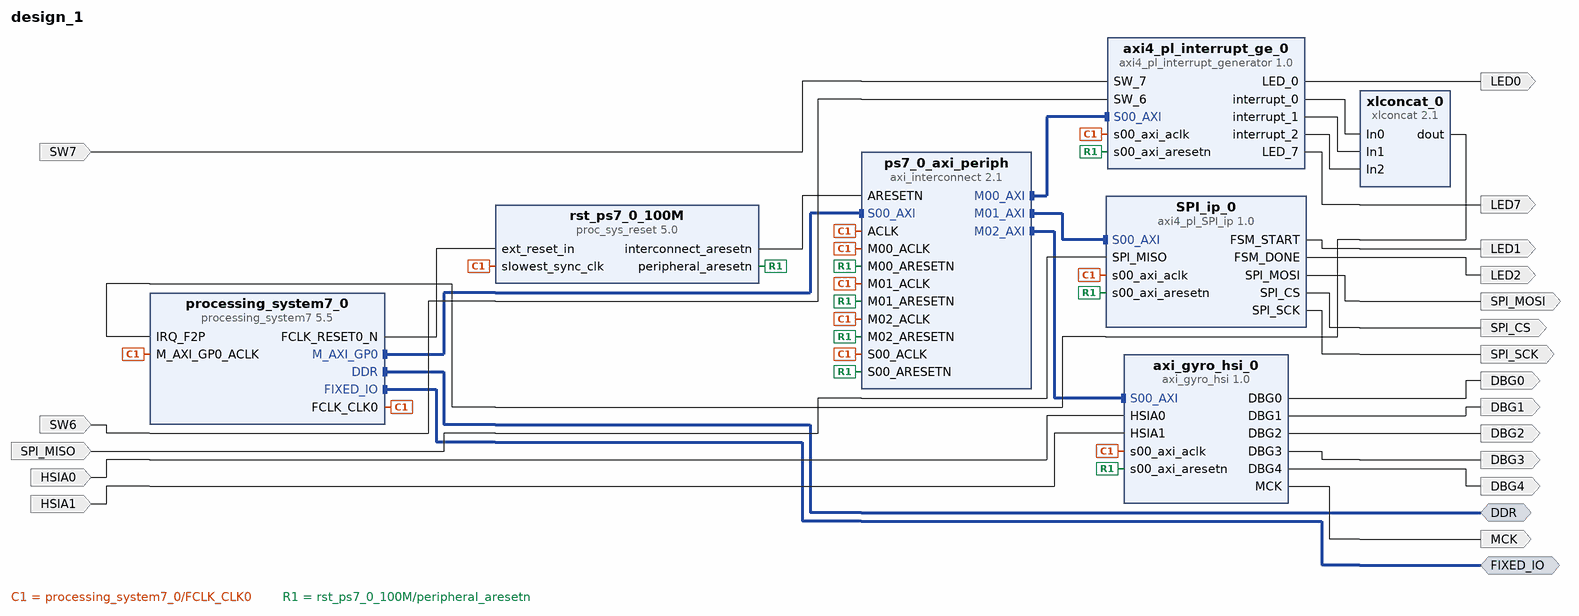
[diagram p0: block diagram of the top level]
# Vivado block design design_1, xc7z020clg484-1, Vivado 2018.2
create_bd_design design_1

create_bd_intf_port -mode Master -vlnv xilinx.com:interface:ddrx_rtl:1.0 DDR
create_bd_intf_port -mode Master -vlnv xilinx.com:display_processing_system7:fixedio_rtl:1.0 FIXED_IO
create_bd_port -dir O -type data LED0
create_bd_port -dir I -type data SW7
create_bd_port -dir O -type data LED7
create_bd_port -dir I -type data SW6
create_bd_port -dir I -type data SPI_MISO
create_bd_port -dir O -type data SPI_MOSI
create_bd_port -dir O -type data SPI_SCK
create_bd_port -dir O -type data SPI_CS
create_bd_port -dir O -type data LED1
create_bd_port -dir O -type data LED2
create_bd_port -dir I -type data HSIA0
create_bd_port -dir I -type data HSIA1
create_bd_port -dir O -type data DBG0
create_bd_port -dir O -type data DBG1
create_bd_port -dir O -type data DBG2
create_bd_port -dir O -type data DBG3
create_bd_port -dir O -type data DBG4
create_bd_port -dir O -type data MCK

create_bd_cell -type ip -vlnv xilinx.com:ip:processing_system7:5.5 processing_system7_0
set_property -dict [list \
  CONFIG.PCW_UIPARAM_DDR_FREQ_MHZ 533.333313 \
  CONFIG.PCW_APU_PERIPHERAL_FREQMHZ 666.666667 \
  CONFIG.PCW_SDIO_PERIPHERAL_FREQMHZ 50 \
  CONFIG.PCW_UART_PERIPHERAL_FREQMHZ 50 \
  CONFIG.PCW_FPGA0_PERIPHERAL_FREQMHZ 100.000000 \
  CONFIG.PCW_FPGA1_PERIPHERAL_FREQMHZ 150.000000 \
  CONFIG.PCW_USE_FABRIC_INTERRUPT 1 \
  CONFIG.PCW_IRQ_F2P_INTR 1 \
  CONFIG.PCW_PRESET_BANK1_VOLTAGE {LVCMOS 1.8V} \
  CONFIG.PCW_UIPARAM_DDR_PARTNO {MT41J128M16 HA-15E} \
  CONFIG.PCW_QSPI_PERIPHERAL_ENABLE 1 \
  CONFIG.PCW_QSPI_QSPI_IO {MIO 1 .. 6} \
  CONFIG.PCW_QSPI_GRP_SINGLE_SS_ENABLE 1 \
  CONFIG.PCW_QSPI_GRP_SINGLE_SS_IO {MIO 1 .. 6} \
  CONFIG.PCW_SINGLE_QSPI_DATA_MODE x4 \
  CONFIG.PCW_ENET0_PERIPHERAL_ENABLE 1 \
  CONFIG.PCW_ENET0_ENET0_IO {MIO 16 .. 27} \
  CONFIG.PCW_ENET0_GRP_MDIO_ENABLE 1 \
  CONFIG.PCW_ENET0_GRP_MDIO_IO {MIO 52 .. 53} \
  CONFIG.PCW_ENET_RESET_ENABLE 1 \
  CONFIG.PCW_ENET_RESET_SELECT {Share reset pin} \
  CONFIG.PCW_ENET0_RESET_ENABLE 0 \
  CONFIG.PCW_SD0_PERIPHERAL_ENABLE 1 \
  CONFIG.PCW_SD0_SD0_IO {MIO 40 .. 45} \
  CONFIG.PCW_SD0_GRP_CD_ENABLE 1 \
  CONFIG.PCW_SD0_GRP_CD_IO {MIO 47} \
  CONFIG.PCW_SD0_GRP_WP_ENABLE 1 \
  CONFIG.PCW_SD0_GRP_WP_IO {MIO 46} \
  CONFIG.PCW_UART1_PERIPHERAL_ENABLE 1 \
  CONFIG.PCW_UART1_UART1_IO {MIO 48 .. 49} \
  CONFIG.PCW_TTC0_PERIPHERAL_ENABLE 1 \
  CONFIG.PCW_TTC0_TTC0_IO EMIO \
  CONFIG.PCW_USB0_PERIPHERAL_ENABLE 1 \
  CONFIG.PCW_USB0_USB0_IO {MIO 28 .. 39} \
  CONFIG.PCW_USB_RESET_ENABLE 1 \
  CONFIG.PCW_USB_RESET_SELECT {Share reset pin} \
  CONFIG.PCW_USB0_RESET_ENABLE 0 \
  CONFIG.PCW_I2C_RESET_ENABLE 1 \
  CONFIG.PCW_GPIO_MIO_GPIO_ENABLE 1 \
  CONFIG.PCW_GPIO_MIO_GPIO_IO MIO \
  CONFIG.preset ZedBoard \
] [get_bd_cells processing_system7_0]
# 223 more settings of processing_system7_0 are not shown: defaults, MIO pin electricals, DDR timing, and values the tool derives
create_bd_cell -type ip -vlnv xilinx.com:ip:axi_interconnect:2.1 ps7_0_axi_periph
set_property -dict {CONFIG.NUM_MI 3} [get_bd_cells ps7_0_axi_periph]
create_bd_cell -type ip -vlnv xilinx.com:ip:proc_sys_reset:5.0 rst_ps7_0_100M
create_bd_cell -type ip -vlnv xilinx.com:ip:xlconcat:2.1 xlconcat_0
set_property -dict {CONFIG.NUM_PORTS 3} [get_bd_cells xlconcat_0]
create_bd_cell -type ip -vlnv xilinx.com:user:axi4_pl_interrupt_generator:1.0 axi4_pl_interrupt_ge_0
create_bd_cell -type ip -vlnv xilinx.com:user:axi4_pl_SPI_ip:1.0 SPI_ip_0
create_bd_cell -type ip -vlnv xilinx.com:user:axi_gyro_hsi:1.0 axi_gyro_hsi_0

# ---- connections ----

connect_bd_intf_net [get_bd_intf_pins processing_system7_0/M_AXI_GP0] [get_bd_intf_pins ps7_0_axi_periph/S00_AXI]
connect_bd_intf_net [get_bd_intf_pins ps7_0_axi_periph/M00_AXI] [get_bd_intf_pins axi4_pl_interrupt_ge_0/S00_AXI]
connect_bd_intf_net [get_bd_intf_pins ps7_0_axi_periph/M01_AXI] [get_bd_intf_pins SPI_ip_0/S00_AXI]
connect_bd_intf_net [get_bd_intf_pins ps7_0_axi_periph/M02_AXI] [get_bd_intf_pins axi_gyro_hsi_0/S00_AXI]
connect_bd_intf_net [get_bd_intf_ports DDR] [get_bd_intf_pins processing_system7_0/DDR]
connect_bd_intf_net [get_bd_intf_ports FIXED_IO] [get_bd_intf_pins processing_system7_0/FIXED_IO]
connect_bd_net [get_bd_pins processing_system7_0/FCLK_CLK0] \
  [get_bd_pins processing_system7_0/M_AXI_GP0_ACLK] [get_bd_pins rst_ps7_0_100M/slowest_sync_clk] \
  [get_bd_pins axi4_pl_interrupt_ge_0/s00_axi_aclk] [get_bd_pins SPI_ip_0/s00_axi_aclk] [get_bd_pins ps7_0_axi_periph/ACLK] \
  [get_bd_pins ps7_0_axi_periph/S00_ACLK] [get_bd_pins ps7_0_axi_periph/M00_ACLK] [get_bd_pins ps7_0_axi_periph/M01_ACLK] \
  [get_bd_pins ps7_0_axi_periph/M02_ACLK] [get_bd_pins axi_gyro_hsi_0/s00_axi_aclk]
connect_bd_net [get_bd_pins processing_system7_0/FCLK_RESET0_N] [get_bd_pins rst_ps7_0_100M/ext_reset_in]
connect_bd_net [get_bd_pins rst_ps7_0_100M/peripheral_aresetn] \
  [get_bd_pins axi4_pl_interrupt_ge_0/s00_axi_aresetn] [get_bd_pins SPI_ip_0/s00_axi_aresetn] \
  [get_bd_pins ps7_0_axi_periph/S00_ARESETN] [get_bd_pins ps7_0_axi_periph/M00_ARESETN] \
  [get_bd_pins ps7_0_axi_periph/M01_ARESETN] [get_bd_pins ps7_0_axi_periph/M02_ARESETN] \
  [get_bd_pins axi_gyro_hsi_0/s00_axi_aresetn]
connect_bd_net [get_bd_pins rst_ps7_0_100M/interconnect_aresetn] [get_bd_pins ps7_0_axi_periph/ARESETN]
connect_bd_net [get_bd_pins axi4_pl_interrupt_ge_0/interrupt_0] [get_bd_pins xlconcat_0/In0]
connect_bd_net [get_bd_pins axi4_pl_interrupt_ge_0/interrupt_1] [get_bd_pins xlconcat_0/In1]
connect_bd_net [get_bd_pins xlconcat_0/dout] [get_bd_pins processing_system7_0/IRQ_F2P]
connect_bd_net [get_bd_pins axi4_pl_interrupt_ge_0/LED_0] [get_bd_ports LED0]
connect_bd_net [get_bd_ports SW7] [get_bd_pins axi4_pl_interrupt_ge_0/SW_7]
connect_bd_net [get_bd_pins axi4_pl_interrupt_ge_0/interrupt_2] [get_bd_pins xlconcat_0/In2]
connect_bd_net [get_bd_pins axi4_pl_interrupt_ge_0/LED_7] [get_bd_ports LED7]
connect_bd_net -net SW6_1 [get_bd_ports SW6] [get_bd_pins axi4_pl_interrupt_ge_0/SW_6]
connect_bd_net [get_bd_ports SPI_MISO] [get_bd_pins SPI_ip_0/SPI_MISO]
connect_bd_net [get_bd_pins SPI_ip_0/SPI_MOSI] [get_bd_ports SPI_MOSI]
connect_bd_net [get_bd_pins SPI_ip_0/SPI_SCK] [get_bd_ports SPI_SCK]
connect_bd_net [get_bd_pins SPI_ip_0/SPI_CS] [get_bd_ports SPI_CS]
connect_bd_net [get_bd_pins SPI_ip_0/FSM_START] [get_bd_ports LED1]
connect_bd_net [get_bd_pins SPI_ip_0/FSM_DONE] [get_bd_ports LED2]
connect_bd_net -net HSIA0_1 [get_bd_ports HSIA0] [get_bd_pins axi_gyro_hsi_0/HSIA0]
connect_bd_net -net HSIA1_1 [get_bd_ports HSIA1] [get_bd_pins axi_gyro_hsi_0/HSIA1]
connect_bd_net [get_bd_pins axi_gyro_hsi_0/DBG0] [get_bd_ports DBG0]
connect_bd_net [get_bd_pins axi_gyro_hsi_0/DBG1] [get_bd_ports DBG1]
connect_bd_net [get_bd_pins axi_gyro_hsi_0/DBG2] [get_bd_ports DBG2]
connect_bd_net [get_bd_pins axi_gyro_hsi_0/DBG3] [get_bd_ports DBG3]
connect_bd_net [get_bd_pins axi_gyro_hsi_0/DBG4] [get_bd_ports DBG4]
connect_bd_net [get_bd_pins axi_gyro_hsi_0/MCK] [get_bd_ports MCK]

# ---- address map ----
assign_bd_address -offset 0x43C00000 -range 64K -target_address_space [get_bd_addr_spaces processing_system7_0/Data] [get_bd_addr_segs axi4_pl_interrupt_ge_0/S00_AXI/S00_AXI_reg]
assign_bd_address -offset 0x43C10000 -range 64K -target_address_space [get_bd_addr_spaces processing_system7_0/Data] [get_bd_addr_segs SPI_ip_0/S00_AXI/S00_AXI_reg]
assign_bd_address -offset 0x43C20000 -range 64K -target_address_space [get_bd_addr_spaces processing_system7_0/Data] [get_bd_addr_segs axi_gyro_hsi_0/S00_AXI/S00_AXI_reg]

validate_bd_design
save_bd_design
